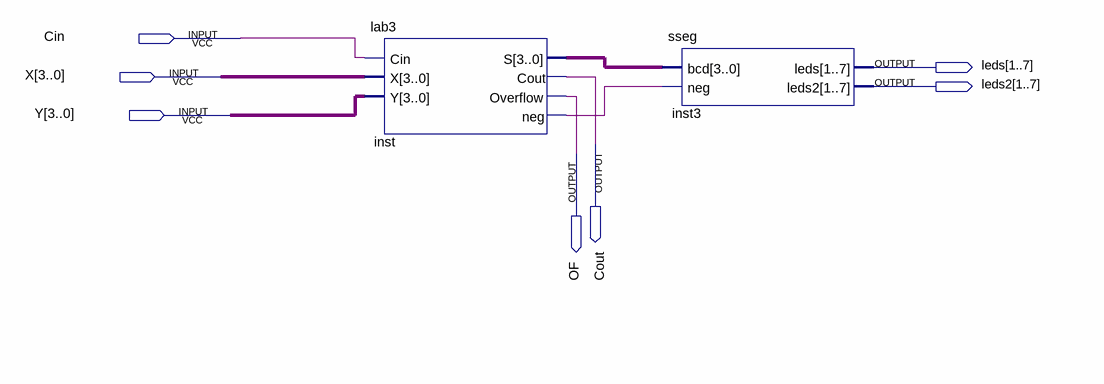
[diagram p0: schematic sheet]
// Quartus schematic combineASU.bdf as structural Verilog: 2 symbols, 7 pins
module combineASU (
  input  Cin,
  input  [3:0] X,
  input  [3:0] Y,
  output [1:7] leds,
  output [1:7] leds2,
  output Cout,
  output OF
);

  wire inst_neg;
  wire [3:0] inst_s;

  lab3 inst (.Cin(Cin), .X(X), .Y(Y), .S(inst_s), .Cout(Cout), .Overflow(OF), .neg(inst_neg));
  sseg inst3 (.bcd(inst_s), .neg(inst_neg), .leds(leds), .leds2(leds2));
endmodule
